# Altium schematic sheet CurrentS_2.SchDoc
size A
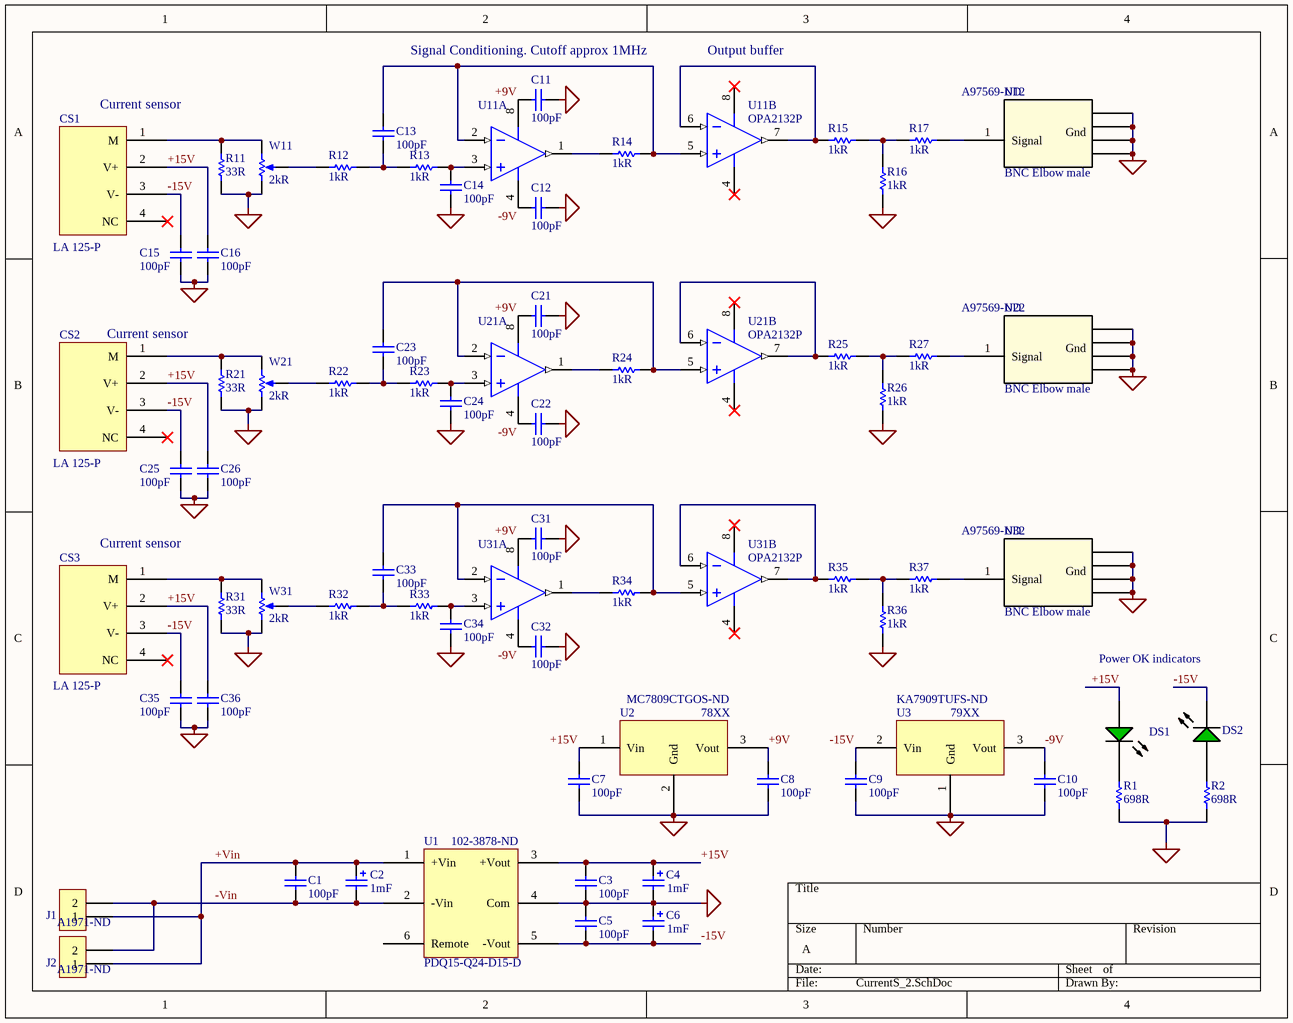
[diagram p0: CurrentS_2.SchDoc]

## Parts
C1  Capacitance: 100pF  [C1206]  (hidden comment: C3216C0G2J101J060AA)
C2  Capacitance: 1mF  [CAP.2/.5]  (hidden comment: ESMG500ELL102MK25S)
C3  Capacitance: 100pF  [C1206]  (hidden comment: C3216C0G2J101J060AA)
C4  Capacitance: 1mF  [CAP.2/.5]  (hidden comment: ESMG500ELL102MK25S)
C5  Capacitance: 100pF  [C1206]  (hidden comment: C3216C0G2J101J060AA)
C6  Capacitance: 1mF  [CAP.2/.5]  (hidden comment: ESMG500ELL102MK25S)
C7  Capacitance: 100pF  [C1206]  (hidden comment: C3216C0G2J101J060AA)
C8  Capacitance: 100pF  [C1206]  (hidden comment: C3216C0G2J101J060AA)
C9  Capacitance: 100pF  [C1206]  (hidden comment: C3216C0G2J101J060AA)
C10  Capacitance: 100pF  [C1206]  (hidden comment: C3216C0G2J101J060AA)
C11  Capacitance: 100pF  [C1206]  (hidden comment: C3216C0G2J101J060AA)
C12  Capacitance: 100pF  [C1206]  (hidden comment: C3216C0G2J101J060AA)
C13  Capacitance: 100pF  [C1206]  (hidden comment: C3216C0G2J101J060AA)
C14  Capacitance: 100pF  [C1206]  (hidden comment: C3216C0G2J101J060AA)
C15  Capacitance: 100pF  [C1206]  (hidden comment: C3216C0G2J101J060AA)
C16  Capacitance: 100pF  [C1206]  (hidden comment: C3216C0G2J101J060AA)
C21  Capacitance: 100pF  [C1206]  (hidden comment: C3216C0G2J101J060AA)
C22  Capacitance: 100pF  [C1206]  (hidden comment: C3216C0G2J101J060AA)
C23  Capacitance: 100pF  [C1206]  (hidden comment: C3216C0G2J101J060AA)
C24  Capacitance: 100pF  [C1206]  (hidden comment: C3216C0G2J101J060AA)
C25  Capacitance: 100pF  [C1206]  (hidden comment: C3216C0G2J101J060AA)
C26  Capacitance: 100pF  [C1206]  (hidden comment: C3216C0G2J101J060AA)
C31  Capacitance: 100pF  [C1206]  (hidden comment: C3216C0G2J101J060AA)
C32  Capacitance: 100pF  [C1206]  (hidden comment: C3216C0G2J101J060AA)
C33  Capacitance: 100pF  [C1206]  (hidden comment: C3216C0G2J101J060AA)
C34  Capacitance: 100pF  [C1206]  (hidden comment: C3216C0G2J101J060AA)
C35  Capacitance: 100pF  [C1206]  (hidden comment: C3216C0G2J101J060AA)
C36  Capacitance: 100pF  [C1206]  (hidden comment: C3216C0G2J101J060AA)
CS1  LA 125-P  [LA 125-P]
CS2  LA 125-P  [LA 125-P]
CS3  LA 125-P  [LA 125-P]
DS1  SML-LXT0805GW-TR  [LUMX-SML-LXT0805_V]  (value not drawn)
DS2  SML-LXT0805GW-TR  [LUMX-SML-LXT0805_V]  (value not drawn)
J1  Supplier Part Number 1: A1971-ND  [3100-8-102-01]  (hidden comment: CON2)
J2  Supplier Part Number 1: A1971-ND  [3100-8-102-01]  (hidden comment: CON2)
R1  Resistance: 698R  [R0805]  (hidden comment: RC0805FR-07698RL)
R2  Resistance: 698R  [R0805]  (hidden comment: RC0805FR-07698RL)
R11  Resistance: 33R  [R0805]  (hidden comment: RC0805JR-0733RL)
R12  Resistance: 1kR  [R0805]  (hidden comment: RC0805FR-071KL)
R13  Resistance: 1kR  [R0805]  (hidden comment: RC0805FR-071KL)
R14  Resistance: 1kR  [R0805]  (hidden comment: RC0805FR-071KL)
R15  Resistance: 1kR  [R0805]  (hidden comment: RC0805FR-071KL)
R16  Resistance: 1kR  [R0805]  (hidden comment: RC0805FR-071KL)
R17  Resistance: 1kR  [R0805]  (hidden comment: RC0805FR-071KL)
R21  Resistance: 33R  [R0805]  (hidden comment: RC0805JR-0733RL)
R22  Resistance: 1kR  [R0805]  (hidden comment: RC0805FR-071KL)
R23  Resistance: 1kR  [R0805]  (hidden comment: RC0805FR-071KL)
R24  Resistance: 1kR  [R0805]  (hidden comment: RC0805FR-071KL)
R25  Resistance: 1kR  [R0805]  (hidden comment: RC0805FR-071KL)
R26  Resistance: 1kR  [R0805]  (hidden comment: RC0805FR-071KL)
R27  Resistance: 1kR  [R0805]  (hidden comment: RC0805FR-071KL)
R31  Resistance: 33R  [R0805]  (hidden comment: RC0805JR-0733RL)
R32  Resistance: 1kR  [R0805]  (hidden comment: RC0805FR-071KL)
R33  Resistance: 1kR  [R0805]  (hidden comment: RC0805FR-071KL)
R34  Resistance: 1kR  [R0805]  (hidden comment: RC0805FR-071KL)
R35  Resistance: 1kR  [R0805]  (hidden comment: RC0805FR-071KL)
R36  Resistance: 1kR  [R0805]  (hidden comment: RC0805FR-071KL)
R37  Resistance: 1kR  [R0805]  (hidden comment: RC0805FR-071KL)
U1  PDQ15-Q24-D15-D  Supplier Part Number 1: 102-3878-ND  [PDQ15-Q24-D15-D]
U2  78XX  Supplier Part Number 1: MC7809CTGOS-ND  [TO-220]
U3  79XX  Supplier Part Number 1: KA7909TUFS-ND  [TO-220]
U11  OPA2132P  [P0008A]  (value not drawn)  (parts A,B of 2)
U12  BNC Elbow male  Supplier Part Number 1: A97569-ND  [5-1814400-1]
U21  OPA2132P  [P0008A]  (value not drawn)  (parts A,B of 2)
U22  BNC Elbow male  Supplier Part Number 1: A97569-ND  [5-1814400-1]
U31  OPA2132P  [P0008A]  (value not drawn)  (parts A,B of 2)
U32  BNC Elbow male  Supplier Part Number 1: A97569-ND  [5-1814400-1]
W11  Resistance: 2kR  [VR5]  (hidden comment: PV36W202C01B00)
W21  Resistance: 2kR  [VR5]  (hidden comment: PV36W202C01B00)
W31  Resistance: 2kR  [VR5]  (hidden comment: PV36W202C01B00)

## Nets
GND: C3.1 C4.2 C5.2 C6.1 C7.1 C8.1 C9.1 C10.1 C11.2 C12.2 C14.1 C15.1 C16.1 C21.2 C22.2 C24.1 C25.1 C26.1 C31.2 C32.2 C34.1 C35.1 C36.1 R1.1 R2.1 R11.1 R16.1 R21.1 R26.1 R31.1 R36.1 U1.4(Com) U2.2(Gnd) U3.1(Gnd) U12.2 U12.3 U12.4 U12.5 U22.2 U22.3 U22.4 U22.5 U32.2 U32.3 U32.4 U32.5 W11.1(TOP) W21.1(TOP) W31.1(TOP)
+9V: C8.2 C11.1 C21.1 C31.1 U2.3(Vout) U11.8(V+) U21.8(V+) U31.8(V+)
+15V: C3.2 C4.1 C7.2 C16.2 C26.2 C36.2 CS1.2(V+) CS2.2(V+) CS3.2(V+) DS1.1(A) U1.3(+Vout) U2.1(Vin)
+Vin: C1.2 C2.1 J1.1 J2.1 U1.1(+Vin)
-9V: C10.2 C12.1 C22.1 C32.1 U3.3(Vout) U11.4(V-) U21.4(V-) U31.4(V-)
-15V: C5.1 C6.2 C9.2 C15.2 C25.2 C35.2 CS1.3(V-) CS2.3(V-) CS3.3(V-) DS2.2(K) U1.5(-Vout) U3.2(Vin)
-Vin: C1.1 C2.2 J1.2 J2.2 U1.2(-Vin)
NetC13_1: C13.1 R12.2 R13.1
NetC13_2: C13.2 R14.2 U11.2(IN_A-) U11.5(IN_B+)
NetC14_2: C14.2 R13.2 U11.3(IN_A+)
NetC23_1: C23.1 R22.2 R23.1
NetC23_2: C23.2 R24.2 U21.2(IN_A-) U21.5(IN_B+)
NetC24_2: C24.2 R23.2 U21.3(IN_A+)
NetC33_1: C33.1 R32.2 R33.1
NetC33_2: C33.2 R34.2 U31.2(IN_A-) U31.5(IN_B+)
NetC34_2: C34.2 R33.2 U31.3(IN_A+)
NetCS1_1: CS1.1(M) R11.2 W11.3(TAP)
NetCS2_1: CS2.1(M) R21.2 W21.3(TAP)
NetCS3_1: CS3.1(M) R31.2 W31.3(TAP)
NetDS1_2: DS1.2(K) R1.2
NetDS2_1: DS2.1(A) R2.2
NetR12_1: R12.1 W11.2(BOT)
NetR14_1: R14.1 U11.1(OUT_A)
NetR15_1: R15.1 U11.6(IN_B-) U11.7(OUT_B)
NetR15_2: R15.2 R16.2 R17.2
NetR17_1: R17.1 U12.1(Signal)
NetR22_1: R22.1 W21.2(BOT)
NetR24_1: R24.1 U21.1(OUT_A)
NetR25_1: R25.1 U21.6(IN_B-) U21.7(OUT_B)
NetR25_2: R25.2 R26.2 R27.2
NetR27_1: R27.1 U22.1(Signal)
NetR32_1: R32.1 W31.2(BOT)
NetR34_1: R34.1 U31.1(OUT_A)
NetR35_1: R35.1 U31.6(IN_B-) U31.7(OUT_B)
NetR35_2: R35.2 R36.2 R37.2
NetR37_1: R37.1 U32.1(Signal)

Not connected (* = marked no-connect by the designer): CS1 4(NC)*; CS2 4(NC)*; CS3 4(NC)*; U1 6(Remote)

## Notes on the sheet
- (near C11) Signal Conditioning. Cutoff approx 1MHz
- Output buffer
- (near CS1) Current sensor
- (near CS2) Current sensor
- (near CS3) Current sensor
- Power OK indicators
- (in symbol BNC Elbow male) Gnd

## Library data of the parts
C1 C3 C5 C7-C16 C21-C26 C31-C36 = C3216C0G2J101J060AA: 100pF ±5% 630V C0G, NP0 Ceramic Capacitor -55°C ~ 125°C Surface Mount, MLCC 1206 (3216 Metric) 0.126" L x 0.063" W (3.20mm x 1.60mm); Manufacturer: TDK; Temperature Coefficient: 30ppm/°C; Supplier 1: Digi-Key; Manufacturer Part Number: C3216C0G2J101J060AA; Stock 1: 40000; Pricing 1: 1=0.28, 10=0.19, 100=0.0961, 500=0.06578, 1000=0.05819 (USD); Mount: Surface Mount; Case/Package: 1206; Weight: 0.000571oz; Case Code (Metric): 3216; Case Code (Imperial): 1206; Min Operating Temperature: -55°C; Max Operating Temperature: 125°C; Packaging: Tape and Reel; Tolerance: 5%; Voltage Rating: 630V; Package Quantity: 1; Voltage Rating (DC): 630V; Dielectric: C0G; Termination: SMD/SMT; Voltage: 630V; Length: 3.2mm; Height: 0.6mm; Width: 0.063inch; Thickness: 0.03inch; Depth: 1.6mm; REACH SVHC: No SVHC; Lead Free: Lead Free; ComponentLink1URL: https://datasheet.ciiva.com/24191/c3216c0g2j101j060aa-24191569.pdf; ComponentLink1Description: https://datasheet.ciiva.com/24191/c3216c0g2j101j060aa-24191569.pdf; ComponentLink2URL: https://datasheet.ciiva.com/46384/1484596-46384214.pdf; ComponentLink2Description: https://datasheet.ciiva.com/46384/1484596-46384214.pdf; ComponentLink3URL: https://datasheet.ciiva.com/11788/0900766b80fc5cba-11788154.pdf; ComponentLink3Description: https://datasheet.ciiva.com/11788/0900766b80fc5cba-11788154.pdf; ComponentLink4URL: https://datasheet.ciiva.com/22677/1484596-22677290.pdf; ComponentLink4Description: https://datasheet.ciiva.com/22677/1484596-22677290.pdf; ComponentLink5URL: https://datasheet.ciiva.com/24219/c3216c0g2j101j060aa-264968-24219087.pdf; ComponentLink5Description: https://datasheet.ciiva.com/24219/c3216c0g2j101j060aa-264968-24219087.pdf; Supplier Part Number 1: 445-2336-6-ND
C2 C4 C6 = ESMG500ELL102MK25S: CAP ALUM 1000UF 20% 50V RADIAL; Manufacturer: United Chemi-Con; Dielectric Material: Aluminium; Ripple Current: 1.34A; Life (Hours): 2000Hour; Supplier 1: Digi-Key; Manufacturer Part Number: ESMG500ELL102MK25S; Stock 1: 1677; Pricing 1: 1=1.32, 10=1.043, 100=0.782, 500=0.59084, 1000=0.52133, 2500=0.48657, 5000=0.46919 (USD); Mount: Through Hole; Case/Package: Radial; Min Operating Temperature: -40°C; Max Operating Temperature: 85°C; Package Quantity: 1000; Tolerance: 20%; Packaging: Bulk; Termination: Radial; Voltage Rating (DC): 50V; Diameter: 12.5mm; Height: 25mm; Lead Pitch: 5mm; Height - Seated (Max): 1.043inch; REACH SVHC: Unknown; Lead Free: Lead Free; ComponentLink1URL: https://datasheet.ciiva.com/99/smg-series-rev-i-99589.pdf; ComponentLink1Description: https://datasheet.ciiva.com/99/smg-series-rev-i-99589.pdf; ComponentLink2URL: https://datasheet.ciiva.com/7931/8790-7931258.pdf; ComponentLink2Description: https://datasheet.ciiva.com/7931/8790-7931258.pdf; ComponentLink3URL: https://datasheet.ciiva.com/15951/12cat-db-al-cgieejppdfnamesmg-cgieejppdfnamesmg-15951254.pdf; ComponentLink3Description: https://datasheet.ciiva.com/15951/12cat-db-al-cgieejppdfnamesmg-cgieejppdfnamesmg-15951254.pdf; Supplier Part Number 1: 565-1114-ND; Voltage Rating: 50V
CS1-CS3 = LA 125-P: Hall-effect current transducer from LEM; Operating Supply Voltage: 15V; Accuracy: 0.8%; Response Time: 1us; Secondary Current: 125mA; Min Supply Voltage (DC): 12V; Max Frequency: 100kHz; Wire/Cable Diameter: 11mm; Supplier 1: Newark; Supplier Part Number 1: 01P0384; Manufacturer: LEM; Manufacturer Part Number: LA125-P; Mount: PCB; Case/Package: 125; Min Operating Temperature: -40°C; Max Operating Temperature: 85°C; Max Supply Voltage (DC): 15V; REACH SVHC: No SVHC; ComponentLink1URL: https://datasheet.ciiva.com/3327/la125p-eng-tds-3327505.pdf; ComponentLink1Description: https://datasheet.ciiva.com/3327/la125p-eng-tds-3327505.pdf; ComponentLink2URL: https://datasheet.ciiva.com/1309/51624-1309927.pdf; ComponentLink2Description: https://datasheet.ciiva.com/1309/51624-1309927.pdf; Stock 1: 82
DS1 DS2 = CMP-1724-00001-1: LED, GREEN, 565 nm, 2 V, -25 to 80 degC, 2-Pin SMD, RoHS, Tape and Reel; Case\/Package: 0805; RoHSCompliant: true; REACH SVHC: No SVHC; Packaging: Tape and Reel; ComponentLink2URL: http://www.lumex.com/content/files/ProductAttachment/SML-LXT0805GW-TR.pdf; ComponentLink1URL: http://www.lumexinstruments.com/; Min Operating Temperature: -25 degC; Max Operating Temperature: 85 degC; DatasheetVersion: Rev. F, 09/2009; Case Code (Metric): 2012; Width: 1.25 mm; PackageDescription: 2-Pin Surface Mount Device, Body 2 x 1.25 mm; ComponentLink1Description: Manufacturer URL; Mount: Surface Mount; PackageReference: SML-LXT0805; Length: 2 mm; Case Code (Imperial): 0805; ComponentLink2Description: Datasheet; Package Quantity: 4000; Mounting Technology: Surface Mount
J1 J2 = CON2: Connector; Manufacturer: TE Connectivity; Manufacturer Part Number: 640445-2; Underplate Material: Nickel; Current Rating: 7A; Number of Positions: 2; Connector Type: Tab; Mating Alignment: No (Without); Contact Resistance: 3mR; Max Voltage Rating (AC): 600V; Connector System: Wire-to-Board; Mating Retention: Yes (With); PCB Mount Retention: Without; Gender: Male; Circuit Application: Power; PCB Mounting Orientation: Vertical; Pitch: 0.156inch; Mating Post Length: 0.4inch; PCB Thickness: 0.063inch; Approvals: CSA; Supplier 1: Digi-Key; Stock 1: 36842; Pricing 1: 1=0.15, 10=0.144, 100=0.0886, 500=0.07332, 1000=0.06416, 5000=0.05499, 10000=0.05347 (USD); Mount: Through Hole,PCB; Contact Plating: Tin; Contact Material: Copper Alloy; Colour: White,Natural; Housing Colour: White; Housing Material: Polyester; Material: Polyester; Min Operating Temperature: -67°C; Max Operating Temperature: 221°C; Number of Rows: 1; Contact Gender: Male; Package Quantity: 1000; Packaging: Bulk; Termination: Solder; Number of Contacts: 2; Shrouded: No (Without); Fastening Type: Friction; Orientation: Straight; Backwall/Post Interruptions: No (Without); Contact Retention: No (Without); Number of Power Positions: 2; PCB Mount Alignment: No (Without); Sealable: No (Without); Strain Relief: No (Without); Contact Current Rating: 7A; Voltage Rating: 600V; Length: 0.312inch; Height: 10.79mm; Depth: 7.62mm; Termination Post Length: 3.18mm; Contact Mating Length: 0.4inch; Radiation Hardening: No; ELV: Compliant; Lead Free: Lead Free; Flammability Rating: UL94 V-0; REACH SVHC: No SVHC; ComponentLink1URL: https://datasheet.ciiva.com/19460/231546-19460984.pdf; ComponentLink1Description: https://datasheet.ciiva.com/19460/231546-19460984.pdf; ComponentLink2URL: https://datasheet.ciiva.com/16200/eng-ds-82056-mta-0608-16200060.pdf; ComponentLink2Description: https://datasheet.ciiva.com/16200/eng-ds-82056-mta-0608-16200060.pdf; ComponentLink3URL: https://datasheet.ciiva.com/3118/eng-ds-82056-mta-0608-3118478.pdf; ComponentLink3Description: https://datasheet.ciiva.com/3118/eng-ds-82056-mta-0608-3118478.pdf; ComponentLink4URL: https://datasheet.ciiva.com/16656/eng-ds-82056-mta-0608-16656510.pdf; ComponentLink4Description: https://datasheet.ciiva.com/16656/eng-ds-82056-mta-0608-16656510.pdf; ComponentLink5URL: https://datasheet.ciiva.com/11747/0900766b812be9d8-11747738.pdf; ComponentLink5Description: https://datasheet.ciiva.com/11747/0900766b812be9d8-11747738.pdf; ComponentLink6URL: https://datasheet.ciiva.com/709/eng-cd-640445-ad1-709687.pdf; ComponentLink6Description: https://datasheet.ciiva.com/709/eng-cd-640445-ad1-709687.pdf; ComponentLink7URL: https://datasheet.ciiva.com/14638/70083689-14638437.pdf; ComponentLink7Description: https://datasheet.ciiva.com/14638/70083689-14638437.pdf; ComponentLink8URL: https://datasheet.ciiva.com/16505/eng-ds-82056-mta-0608-16505416.pdf; ComponentLink8Description: https://datasheet.ciiva.com/16505/eng-ds-82056-mta-0608-16505416.pdf; ComponentLink9URL: https://datasheet.ciiva.com/7703/100170-7703301.pdf; ComponentLink9Description: https://datasheet.ciiva.com/7703/100170-7703301.pdf; ComponentLink10URL: https://datasheet.ciiva.com/48697/001278462-da-01-en-stiftleiste-gerade-640445-2-48697366.pdf; ComponentLink10Description: https://datasheet.ciiva.com/48697/001278462-da-01-en-stiftleiste-gerade-640445-2-48697366.pdf
R1 R2 = RC0805FR-07698RL: RES SMD 698 OHM 1% 1/8W 0805; Manufacturer: Yageo; Max Power Dissipation: 125mW; Temperature Coefficient: 100ppm/°C; Voltage Rating (DC): 150V; Supplier 1: Digi-Key; Manufacturer Part Number: RC0805FR-07698RL; Stock 1: 175243; Pricing 1: 1=0.1, 10=0.042, 100=0.0169, 1000=0.00759, 2500=0.00659 (USD); Case/Package: 0805; Case Code (Metric): 2012; Case Code (Imperial): 0805; Contact Plating: Tin,Matte; Min Operating Temperature: -55°C; Max Operating Temperature: 155°C; Package Quantity: 1; Tolerance: 1%; Packaging: Tape and Reel; Composition: Thick Film; Number of Terminations: 2; Power Rating: 125mW; Voltage Rating: 150V; Termination: SMD/SMT; Military Standard: Not; Length: 2mm; Height: 0.024inch; Width: 0.049inch; Depth: 1.25mm; Radiation Hardening: No; Lead Free: Lead Free; ComponentLink1URL: https://datasheet.ciiva.com/2458/pyu-r-int-thick-7-2458144.pdf; ComponentLink1Description: https://datasheet.ciiva.com/2458/pyu-r-int-thick-7-2458144.pdf; ComponentLink2URL: https://datasheet.ciiva.com/12561/rc0805-257173-12561189.pdf; ComponentLink2Description: https://datasheet.ciiva.com/12561/rc0805-257173-12561189.pdf; ComponentLink3URL: https://datasheet.ciiva.com/17055/rc0805-17055621.pdf; ComponentLink3Description: https://datasheet.ciiva.com/17055/rc0805-17055621.pdf; ComponentLink4URL: https://datasheet.ciiva.com/2458/pyu-r-int-thick-7-2458142.pdf; ComponentLink4Description: https://datasheet.ciiva.com/2458/pyu-r-int-thick-7-2458142.pdf; ComponentLink5URL: https://datasheet.ciiva.com/2458/pyu-r-int-thick-7-2458143.pdf; ComponentLink5Description: https://datasheet.ciiva.com/2458/pyu-r-int-thick-7-2458143.pdf; Supplier Part Number 1: 311-698CRCT-ND
R11 R21 R31 = RC0805JR-0733RL: YAGEO (PHYCOMP)         RC0805JR-0733RL             SMD Chip Resistor, Thick Film, 33 ohm, 150 V, 0805 [2012 Metric], 250 mW,  5%, RC Series; Temperature Coefficient: 100ppm/°C; Power Rating: 125mW; Voltage Rating: 150V; Supplier 1: Digi-Key; Manufacturer: Yageo; Manufacturer Part Number: RC0805JR-0733RL; Stock 1: 49512; Pricing 1: 1=0.1, 10=0.036, 100=0.0145, 1000=0.00652, 2500=0.00566 (USD); Case/Package: 0805; Weight: 0.000194oz; Contact Plating: Tin,Lead,Matte; Case Code (Imperial): 0805; Case Code (Metric): 2012; Min Operating Temperature: -55°C; Max Operating Temperature: 155°C; Tolerance: 5%; Packaging: Tape and Reel; Composition: Thick Film; Termination: SMD/SMT; Military Standard: Not; Length: 2mm; Height: 0.5mm; Width: 1.25mm; Depth: 1.25mm; Radiation Hardening: No; Lead Free: Lead Free; REACH SVHC: Unknown; ComponentLink1URL: https://datasheet.ciiva.com/17053/rc0805-17053447.pdf; ComponentLink1Description: https://datasheet.ciiva.com/17053/rc0805-17053447.pdf; ComponentLink2URL: https://datasheet.ciiva.com/7941/442941-7941947.pdf; ComponentLink2Description: https://datasheet.ciiva.com/7941/442941-7941947.pdf; ComponentLink3URL: https://datasheet.ciiva.com/7941/442941-7941948.pdf; ComponentLink3Description: https://datasheet.ciiva.com/7941/442941-7941948.pdf; Supplier Part Number 1: 311-33ARCT-ND
R12-R17 R22-R27 R32-R37 = RC0805FR-071KL: RES SMD 1K OHM 1% 1/8W 0805; Manufacturer: Yageo; Temperature Coefficient: 100ppm/°C; Voltage Rating (DC): 150V; Power Rating: 125mW; Supplier 1: Digi-Key; Manufacturer Part Number: RC0805FR-071KL; Stock 1: 5400247; Pricing 1: 1=0.1, 10=0.042, 100=0.0169, 1000=0.00759, 2500=0.00659 (USD); Case/Package: 0805; Number of Pins: 2; Case Code (Metric): 2012; Case Code (Imperial): 0805; Min Operating Temperature: -55°C; Max Operating Temperature: 155°C; Tolerance: 1%; Packaging: Tape and Reel; Composition: Thick Film; Package Quantity: 1; Voltage Rating: 150V; Number of Terminations: 2; Termination: SMD/SMT; Military Standard: Not; Max Power Dissipation: 125mW; Length: 0.079inch; Height: 0.024inch; Width: 0.049inch; Depth: 1.25mm; REACH SVHC: Unknown; Lead Free: Lead Free; ComponentLink1URL: https://datasheet.ciiva.com/2456/pyu-r-int-thick-7-2456976.pdf; ComponentLink1Description: https://datasheet.ciiva.com/2456/pyu-r-int-thick-7-2456976.pdf; ComponentLink2URL: https://datasheet.ciiva.com/2456/pyu-r-int-thick-7-2456977.pdf; ComponentLink2Description: https://datasheet.ciiva.com/2456/pyu-r-int-thick-7-2456977.pdf; ComponentLink3URL: https://datasheet.ciiva.com/11819/0900766b8106beab-11819814.pdf; ComponentLink3Description: https://datasheet.ciiva.com/11819/0900766b8106beab-11819814.pdf; ComponentLink4URL: https://datasheet.ciiva.com/7941/1686128-7941719.pdf; ComponentLink4Description: https://datasheet.ciiva.com/7941/1686128-7941719.pdf; ComponentLink5URL: https://datasheet.ciiva.com/16850/rc0805-16850409.pdf; ComponentLink5Description: https://datasheet.ciiva.com/16850/rc0805-16850409.pdf; ComponentLink6URL: https://datasheet.ciiva.com/46385/444164-46385020.pdf; ComponentLink6Description: https://datasheet.ciiva.com/46385/444164-46385020.pdf; ComponentLink7URL: https://datasheet.ciiva.com/2456/pyu-r-int-thick-7-2456975.pdf; ComponentLink7Description: https://datasheet.ciiva.com/2456/pyu-r-int-thick-7-2456975.pdf; Supplier Part Number 1: 311-1.00KCRCT-ND
U1 = PDQ15-Q24-D15-D: Isolated DC/DC Converters 15W 9-36Vin +/-15V +/-500mA Iso Reg DIP; Supplier 1: Digi-Key
U2 = 78XX: IC REG LINEAR 9V 1A TO220AB; Manufacturer: ON Semiconductor; Manufacturer Part Number: MC7809CTG; Number of Outputs: 1; Dropout Voltage: 2V; Max Input Voltage: 35V; Min Input Voltage: 11V; Polarity: Positive; Quiescent Current: 8mA; Accuracy: 4%; Tolerance: 5%; Power Supply Rejection Ratio (PSRR): 61dB; Supplier 1: Digi-Key; Stock 1: 1049; Pricing 1: 1=0.64, 10=0.548, 100=0.4091, 500=0.32142, 1000=0.24837 (USD); Mount: Through Hole; Case/Package: TO-220; Number of Pins: 3; Weight: 0.01lb; Contact Plating: Tin,Matte; Min Operating Temperature: 0°C; Max Operating Temperature: 125°C; Output Voltage: 9V; Packaging: Rail/Tube; Output Current: 1A; Current Rating: 1A; Package Quantity: 50; Max Output Current: 1A; Nominal Output Voltage: 9V; Number of Regulators: 1; Min Output Voltage: 9V; Output Voltage Accuracy: 4%; Operating Supply Voltage: 35V; Length: 0.404inch; Height: 0.62inch; Width: 0.19inch; Radiation Hardening: No; REACH SVHC: No SVHC; Lead Free: Lead Free; Halogen Free: Halogen Free; ComponentLink1URL: https://datasheet.ciiva.com/16394/mc7800-d-16394474.pdf; ComponentLink1Description: https://datasheet.ciiva.com/16394/mc7800-d-16394474.pdf; ComponentLink2URL: https://datasheet.ciiva.com/14149/igspannungsregler-mc78xx-en-14149791.pdf; ComponentLink2Description: https://datasheet.ciiva.com/14149/igspannungsregler-mc78xx-en-14149791.pdf; ComponentLink3URL: https://datasheet.ciiva.com/8073/76526-8073704.pdf; ComponentLink3Description: https://datasheet.ciiva.com/8073/76526-8073704.pdf; ComponentLink4URL: https://datasheet.ciiva.com/25979/mc7800-d-25979775.pdf; ComponentLink4Description: https://datasheet.ciiva.com/25979/mc7800-d-25979775.pdf; ComponentLink5URL: https://datasheet.ciiva.com/2043/mc7800-d-2043830.pdf; ComponentLink5Description: https://datasheet.ciiva.com/2043/mc7800-d-2043830.pdf; ComponentLink6URL: https://datasheet.ciiva.com/26903/mc7809ctg-26903014.pdf; ComponentLink6Description: https://datasheet.ciiva.com/26903/mc7809ctg-26903014.pdf
U3 = 79XX: IC REG LINEAR -9V 1A TO220-3; Manufacturer: ON Semiconductor / Fairchild; Manufacturer Part Number: KA7909TU; Number of Outputs: 1; Dropout Voltage: 2V; Max Input Voltage: -35V; Min Input Voltage: -11.5V; Polarity: Negative; Quiescent Current: 6mA; Output Voltage Accuracy: 4%; Tolerance: 5%; Power Supply Rejection Ratio (PSRR): 60dB; Supplier 1: Digi-Key; Stock 1: 820; Pricing 1: 1=0.66, 10=0.581, 100=0.4453, 500=0.352, 1000=0.2816 (USD); Mount: Through Hole; Case/Package: TO-220-3; Number of Pins: 3; Weight: 1.8g; Min Operating Temperature: 0°C; Max Operating Temperature: 125°C; Output Voltage: -9V; Packaging: Rail/Tube; Package Quantity: 50; Output Current: 1A; Max Output Current: 1A; Nominal Output Voltage: -9V; Number of Regulators: 1; Min Output Voltage: -9V; Accuracy: 4%; Length: 10mm; Height: 15.95mm; Width: 4.5mm; Radiation Hardening: No; REACH SVHC: No SVHC; Lead Free: Lead Free; ComponentLink1URL: https://datasheet.ciiva.com/14170/zpfairchild-spannungsregler-ka-en-14170555.pdf; ComponentLink1Description: https://datasheet.ciiva.com/14170/zpfairchild-spannungsregler-ka-en-14170555.pdf; ComponentLink2URL: https://datasheet.ciiva.com/26254/ka7924-26254938.pdf; ComponentLink2Description: https://datasheet.ciiva.com/26254/ka7924-26254938.pdf; ComponentLink3URL: https://datasheet.ciiva.com/46425/1855684-46425549.pdf; ComponentLink3Description: https://datasheet.ciiva.com/46425/1855684-46425549.pdf; ComponentLink4URL: https://datasheet.ciiva.com/3224/ka7924-3224893.pdf; ComponentLink4Description: https://datasheet.ciiva.com/3224/ka7924-3224893.pdf; ComponentLink5URL: https://datasheet.ciiva.com/17366/ka7909-17366829.pdf; ComponentLink5Description: https://datasheet.ciiva.com/17366/ka7909-17366829.pdf
U11 U21 U31 = CMP-0271-00384-3: High Speed FET-Input Operational Amplifier, 5 to 36 V, -40 to 125 degC, 8-pin DIP (P8), Green (RoHS & no Sb/Br); Manufacturer: Texas Instruments; GBW(Typ)(MHz): 8; Total Supply Voltage(Max)(+5V is 5, +/-5V is 10): 36; Iq per channel(Max)(mA): 4.8; Slew Rate(Typ)(V/us): 20; Offset Drift(Typ)(uV/C): 2; Vio (25C)(Max)(mV): 0.5; Total Supply Voltage(Min)(+5V is 5, +/-5V is 10): 5; IIB(Max)(pA): 50; Packing: TUBE; CMRR(Min)(dB): 96; Rating: Catalog; Sub Family: High Supply Voltage Amplifier (>=30V), Low Noise Amp (<=10nV/rtHz), Low Offset Voltage Amplifier (<=500uV), Precision Amplifier; ComponentLink1URL: http://www.ti.com/; ComponentLink3URL: http://www.ti.com/litv/pdf/mpdi001b; ComponentLink2URL: http://www.ti.com/lit/ds/symlink/opa2132.pdf; PackageReference: P0008A; Eco-Plan: Green (RoHS & no Sb/Br); ComponentLink3Description: Package Specification; PartNumber: OPA2132P; Code_JEDEC: MS-001; Mounting Technology: Through Hole; PackageDescription: 8-Pin Plastic In-Line, Body 9.59 x 6.35 mm, Pitch 2.54 mm; Number of Channels: 2; ComponentLink2Description: Datasheet; DatasheetVersion: SBOS054A; ComponentLink1Description: Manufacturer URL; PackageVersion: 4040082/E, 04/2010
U12 U22 U32 = BNC Elbow male: BNC Low Profile Elbow Connector; Manufacturer_Part_Number: 5-1634513-1; Manufacturer: TE Connectivity; Vendor: Tyco Electronics; Body Material: Zinc; Body Plating: Nickel; Dielectric Material: PTFE; Impedance: 50R; Contact Resistance: 1.5mR; Mating Cycles: 50; Gender: Female; Frequency: 2GHz; Connector Type: BNC,Jack; Insulation Resistance: 5GR; Working Voltage: 500V; Polarity: Normal; Number of Positions: 1; PCB Mount Retention: With; PCB Mounting Orientation: Right Angle; Sealable: No (Without); PCB Thickness: 0.126inch; Copyright: Copyright (C) 2015 Accelerated Designs. All rights reserved; Value: Value; Type: Type; RefDes: RefDes; Supplier 1: Digi-Key; Manufacturer Part Number: 5-1634513-1; Stock 1: 1905; Pricing 1: 1=3.31, 10=3.18, 25=2.9148, 50=2.7824, 100=2.6498, 250=2.3186, 500=2.25234, 1000=1.92112, 2500=1.78863 (USD); Mount: Through Hole,PCB; Contact Material: Bronze; Contact Plating: Gold; Insulation Material: Polytetrafluoroethylene; Min Operating Temperature: -55°C; Max Operating Temperature: 85°C; Packaging: Tray; Package Quantity: 100; Fastening Type: Bayonet; Termination: Solder; Max Frequency: 2GHz; Orientation: Right Angle; Length: 28.1mm; Depth: 11mm; Radiation Hardening: No; REACH SVHC: Unknown; ComponentLink1URL: https://datasheet.ciiva.com/9423/eng-cd-1634513-c-9423831.pdf; ComponentLink1Description: https://datasheet.ciiva.com/9423/eng-cd-1634513-c-9423831.pdf; ComponentLink2URL: https://datasheet.ciiva.com/1448/49781-1448584.pdf; ComponentLink2Description: https://datasheet.ciiva.com/1448/49781-1448584.pdf; ComponentLink3URL: https://datasheet.ciiva.com/5757/49781-5757585.pdf; ComponentLink3Description: https://datasheet.ciiva.com/5757/49781-5757585.pdf; ComponentLink4URL: https://datasheet.ciiva.com/14567/70084641-14567974.pdf; ComponentLink4Description: https://datasheet.ciiva.com/14567/70084641-14567974.pdf; ComponentLink5URL: https://datasheet.ciiva.com/642/eng-cd-1634513-e-642840.pdf; ComponentLink5Description: https://datasheet.ciiva.com/642/eng-cd-1634513-e-642840.pdf; ComponentLink6URL: https://datasheet.ciiva.com/16652/eng-cd-1634513-c-16652898.pdf; ComponentLink6Description: https://datasheet.ciiva.com/16652/eng-cd-1634513-c-16652898.pdf; ComponentLink7URL: https://datasheet.ciiva.com/11762/0900766b807b5959-11762602.pdf; ComponentLink7Description: https://datasheet.ciiva.com/11762/0900766b807b5959-11762602.pdf
W11 W21 W31 = PV36W202C01B00: TRIMMER 2K OHM 0.5W TH; Manufacturer: Bourns; Tolerance: 10%; Number of Turns: 25; Max Power Dissipation: 500mW; Temperature Coefficient: 100ppm/°C; Supplier 1: Digi-Key; Manufacturer Part Number: PV36W202C01B00; Stock 1: 2656; Pricing 1: 1=1.5, 10=1.32, 25=1.188, 50=1.144, 100=1.1, 250=1.034, 500=0.88, 1000=0.814, 5000=0.6688 (USD); Mount: Through Hole; Packaging: Bulk; Termination: PC Pins; Composition: Cermet; Height: 0.394inch; ComponentLink1URL: http://www.bourns.com/docs/Product-Datasheets/pv36.pdf; ComponentLink1Description: http://www.bourns.com/docs/Product-Datasheets/pv36.pdf; ComponentLink2URL: http://www.mouser.com/ds/2/54/v36-907345.pdf; ComponentLink2Description: http://www.mouser.com/ds/2/54/v36-907345.pdf; Supplier Part Number 1: 490-2880-ND